# Altium schematic sheet FT601.SchDoc: FT601_V2
size A4; Date: 2019/08/25; CheckedBy: A Kadis; Author: DM Dong,YC Wang; CompanyName: CMMPE; DrawnBy: Daoming Dong, Youchao Wang; Revision: A; SheetNumber: 1; SheetTotal: 4
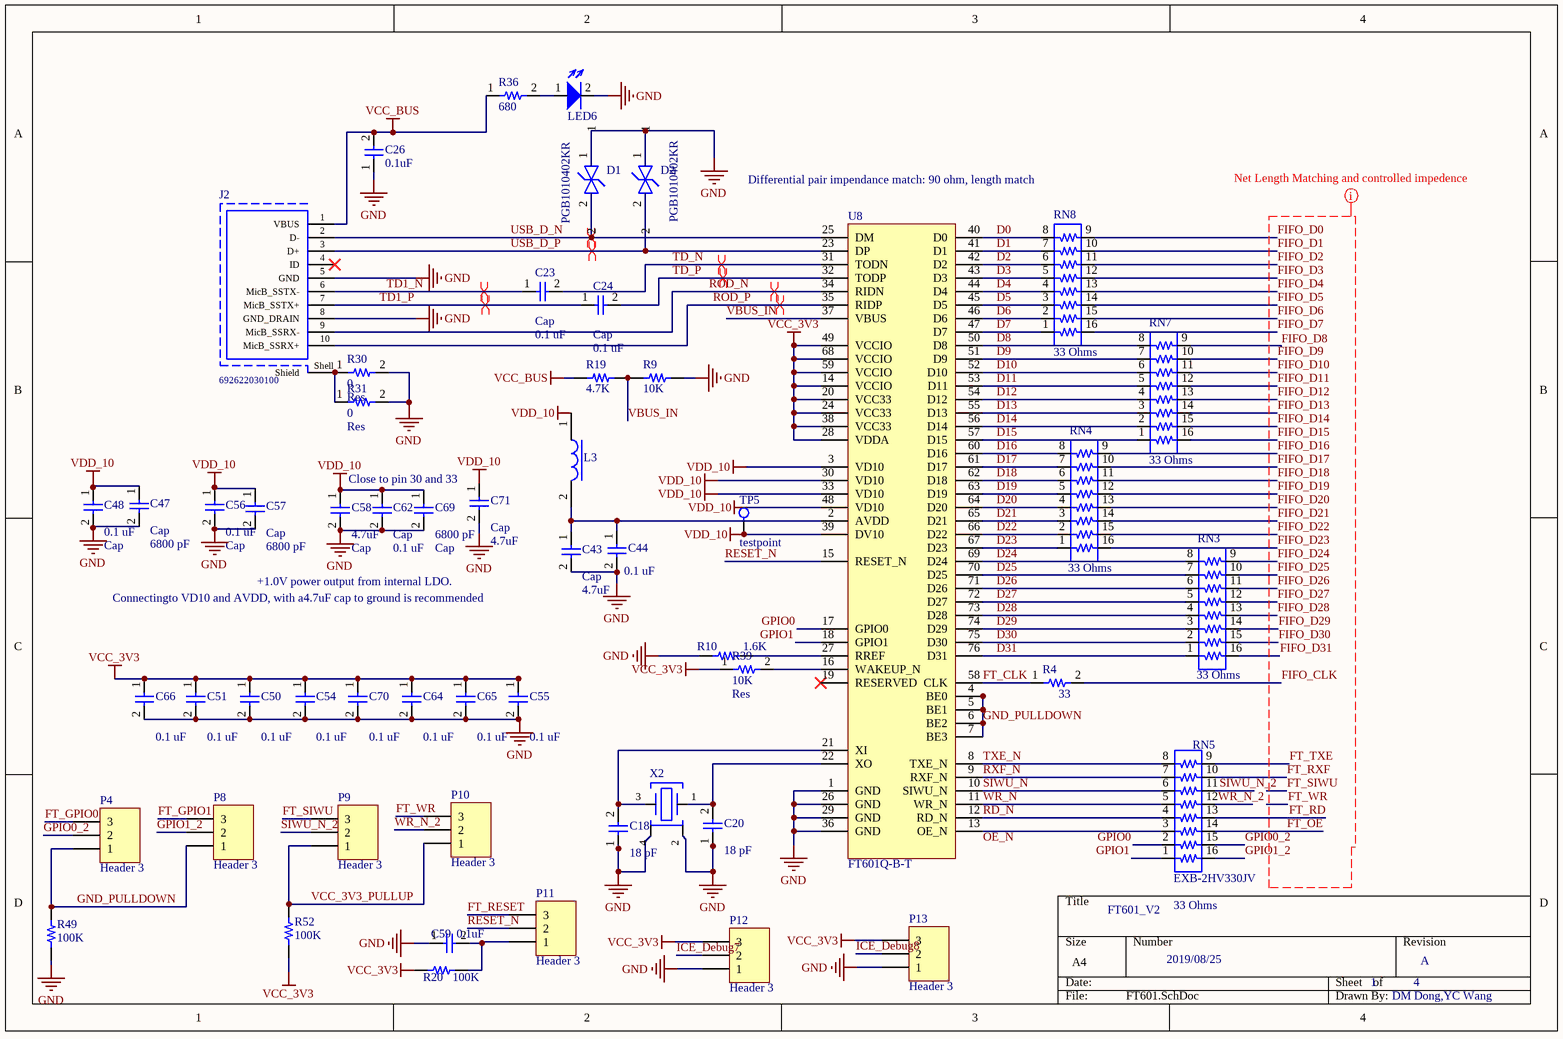
[diagram p0: FT601.SchDoc]

## Parts
C18  value 18 pF  [CAP_18pF_0603]  (hidden comment: C0603C180K5RACAUTO)
C20  value 18 pF  [CAP_18pF_0603]  (hidden comment: C0603C180K5RACAUTO)
C23  value 0.1 uF  Component Name: Cap  [Cap_0.1uF_0402]  (hidden comment: CC0402KPX5R6BB104)
C24  value 0.1 uF  Component Name: Cap  [Cap_0.1uF_0402]  (hidden comment: CC0402KPX5R6BB104)
C26  value 0.1uF  [Cap_0.1uF]  (hidden comment: AC0603KRX7R9BB104)
C43  value 4.7uF  Component Name: Cap  [CAP_4.7uF_0402]  (hidden comment: C1005X5R0J475K050BC)
C44  value 0.1 uF  [Cap_0.1uF_0402]  (hidden comment: CC0402KPX5R6BB104)
C47  value 6800 pF  Component Name: Cap  [CAP_6700pF_0402]  (hidden comment: C0402C682K5RECAUTO)
C48  value 0.1 uF  Component Name: Cap  [Cap_0.1uF_0402]  (hidden comment: CC0402KPX5R6BB104)
C50  value 0.1 uF  [Cap_0.1uF_0402]  (hidden comment: CC0402KPX5R6BB104)
C51  value 0.1 uF  [Cap_0.1uF_0402]  (hidden comment: CC0402KPX5R6BB104)
C54  value 0.1 uF  [Cap_0.1uF_0402]  (hidden comment: CC0402KPX5R6BB104)
C55  value 0.1 uF  [Cap_0.1uF_0402]  (hidden comment: CC0402KPX5R6BB104)
C56  value 0.1 uF  Component Name: Cap  [Cap_0.1uF_0402]  (hidden comment: CC0402KPX5R6BB104)
C57  value 6800 pF  Component Name: Cap  [CAP_6700pF_0402]  (hidden comment: C0402C682K5RECAUTO)
C58  value 4.7uF  Component Name: Cap  [CAP_4.7uF_0402]  (hidden comment: C1005X5R0J475K050BC)
C59  value 0.1uF  [Cap_0.1uF]  (hidden comment: AC0603KRX7R9BB104)
C62  value 0.1 uF  Component Name: Cap  [Cap_0.1uF_0402]  (hidden comment: CC0402KPX5R6BB104)
C64  value 0.1 uF  [Cap_0.1uF_0402]  (hidden comment: CC0402KPX5R6BB104)
C65  value 0.1 uF  [Cap_0.1uF_0402]  (hidden comment: CC0402KPX5R6BB104)
C66  value 0.1 uF  [Cap_0.1uF_0402]  (hidden comment: CC0402KPX5R6BB104)
C69  value 6800 pF  Component Name: Cap  [CAP_6700pF_0402]  (hidden comment: C0402C682K5RECAUTO)
C70  value 0.1 uF  [Cap_0.1uF_0402]  (hidden comment: CC0402KPX5R6BB104)
C71  value 4.7uF  Component Name: Cap  [CAP_4.7uF_0402]  (hidden comment: C1005X5R0J475K050BC)
D1  PGB1010402KR  [ESD_Suppressor]
D2  PGB1010402KR  [ESD_Suppressor]
J2  692622030100  [692622030100]
L3  BLM18PG300SZ1D  [FerriteBeads]  (value not drawn)
LED6  TLMS1000-GS08  [LED_RED]  (value not drawn)
P4  Header 3  [HDR1X3]
P8  Header 3  [HDR1X3]
P9  Header 3  [HDR1X3]
P10  Header 3  [HDR1X3]
P11  Header 3  [HDR1X3]
P12  Header 3  [HDR1X3]
P13  Header 3  [HDR1X3]
R4  value 33  [Res_33_0402]  (hidden comment: ERJ2RKD33R0X)
R9  value 10K  [RES_10K]  (hidden comment: RT0603WRE0710KL)
R10  value 1.6K  [RES_1.6K]  (hidden comment: ERJ-3RBD1601V)
R19  value 4.7K  [RES_4.7K]  (hidden comment: AC0603JR-134K7L)
R20  value 100K  [RES_100K]  (hidden comment: SR0603KR-07100KL)
R30  value 0  Component Name: Res  [RES_0]  (hidden comment: CRCW06030000Z0EAC)
R31  value 0  Component Name: Res  [RES_0]  (hidden comment: CRCW06030000Z0EAC)
R36  value 680  [RES_680]  (hidden comment: RT0603FRE13680RL)
R39  value 10K  Component Name: Res  [RES_10K]  (hidden comment: RT0603WRE0710KL)
R49  value 100K  [RESC1607X60N]  (hidden comment: SR0603KR-07100KL)
R52  value 100K  [RESC1607X60N]  (hidden comment: SR0603KR-07100KL)
RN3  value 33 Ohms  [ResArray_0]  (hidden comment: EXB-2HV330JV)
RN4  value 33 Ohms  [ResArray_0]  (hidden comment: EXB-2HV330JV)
RN5  EXB-2HV330JV  value 33 Ohms  [ResArray_0]
RN7  value 33 Ohms  [ResArray_0]  (hidden comment: EXB-2HV330JV)
RN8  value 33 Ohms  [ResArray_0]  (hidden comment: EXB-2HV330JV)
TP5  testpoint  [testpoint]
U8  FT601Q-B-T  [FT601_NoGND_Pad]
X2  ABM8G-30.000MHZ-18-D2Y-T  [30MHzOscillatorV2]  (value not drawn)

## Nets
GND: C18.1 C20.1 C26.1 C43.2 C44.2 C47.2 C48.2 C50.2 C51.2 C54.2 C55.2 C56.2 C57.2 C58.2 C59.1 C62.2 C64.2 C65.2 C66.2 C69.2 C70.2 C71.2 D1.1 D2.1 J2.5(GND) J2.8(GND_DRAIN) LED6.2(Cathode) P12.1 P13.1 R9.1 R10.1 R30.2 R31.2 R49.1 U8.1(GND) U8.26(GND) U8.29(GND) U8.36(GND) X2.2(GND) X2.4(GND)
VCC_3V3: C50.1 C51.1 C54.1 C55.1 C64.1 C65.1 C66.1 C70.1 P12.3 P13.3 R20.1 R39.1 R52.1 U8.14(VCCIO) U8.20(VCC33) U8.24(VCC33) U8.28(VDDA) U8.38(VCC33) U8.49(VCCIO) U8.59(VCCIO) U8.68(VCCIO)
VCC_BUS: C26.2 J2.1(VBUS) R19.2 R36.1
VDD_10: C47.1 C48.1 C56.1 C57.1 C58.1 C62.1 C69.1 C71.1 L3.1 TP5.1 U8.3(VD10) U8.30(VD10) U8.33(VD10) U8.39(DV10) U8.48(VD10)
D0: RN8.8 U8.40(D0)
D1: RN8.7 U8.41(D1)
D2: RN8.6 U8.42(D2)
D3: RN8.5 U8.43(D3)
D4: RN8.4 U8.44(D4)
D5: RN8.3 U8.45(D5)
D6: RN8.2 U8.46(D6)
D7: RN8.1 U8.47(D7)
D8: RN7.8 U8.50(D8)
D9: RN7.7 U8.51(D9)
D10: RN7.6 U8.52(D10)
D11: RN7.5 U8.53(D11)
D12: RN7.4 U8.54(D12)
D13: RN7.3 U8.55(D13)
D14: RN7.2 U8.56(D14)
D15: RN7.1 U8.57(D15)
D16: RN4.8 U8.60(D16)
D17: RN4.7 U8.61(D17)
D18: RN4.6 U8.62(D18)
D19: RN4.5 U8.63(D19)
D20: RN4.4 U8.64(D20)
D21: RN4.3 U8.65(D21)
D22: RN4.2 U8.66(D22)
D23: RN4.1 U8.67(D23)
D24: RN3.8 U8.69(D24)
D25: RN3.7 U8.70(D25)
D26: RN3.6 U8.71(D26)
D27: RN3.5 U8.72(D27)
D28: RN3.4 U8.73(D28)
D29: RN3.3 U8.74(D29)
D30: RN3.2 U8.75(D30)
D31: RN3.1 U8.76(D31)
FIFO_CLK: R4.2
FIFO_D0: RN8.9
FIFO_D1: RN8.10
FIFO_D2: RN8.11
FIFO_D3: RN8.12
FIFO_D4: RN8.13
FIFO_D5: RN8.14
FIFO_D6: RN8.15
FIFO_D7: RN8.16
FIFO_D8: RN7.9
FIFO_D9: RN7.10
FIFO_D10: RN7.11
FIFO_D11: RN7.12
FIFO_D12: RN7.13
FIFO_D13: RN7.14
FIFO_D14: RN7.15
FIFO_D15: RN7.16
FIFO_D16: RN4.9
FIFO_D17: RN4.10
FIFO_D18: RN4.11
FIFO_D19: RN4.12
FIFO_D20: RN4.13
FIFO_D21: RN4.14
FIFO_D22: RN4.15
FIFO_D23: RN4.16
FIFO_D24: RN3.9
FIFO_D25: RN3.10
FIFO_D26: RN3.11
FIFO_D27: RN3.12
FIFO_D28: RN3.13
FIFO_D29: RN3.14
FIFO_D30: RN3.15
FIFO_D31: RN3.16
FT_CLK: R4.1 U8.58(CLK)
FT_GPIO0: P4.3
FT_GPIO1: P8.3
FT_OE: RN5.14
FT_RD: RN5.13
FT_RESET: P11.3
FT_RXF: RN5.10
FT_SIWU: P9.3
FT_TXE: RN5.9
FT_WR: P10.3
GND_PULLDOWN: P4.1 P8.1 R49.2 U8.4(BE0) U8.5(BE1) U8.6(BE2) U8.7(BE3)
GPIO0: RN5.2 U8.17(GPIO0)
GPIO0_2: P4.2 RN5.15
GPIO1: RN5.1 U8.18(GPIO1)
GPIO1_2: P8.2 RN5.16
ICE_Debug7: P12.2
ICE_Debug8: P13.2
RD_N: RN5.4 U8.12(RD_N)
RESET_N: P11.2 U8.15(RESET_N)
ROD_N: J2.9(MicB_SSRX-) U8.34(RIDN)
ROD_P: J2.10(MicB_SSRX+) U8.35(RIDP)
RXF_N: RN5.7 U8.9(RXF_N)
SIWU_N: RN5.6 U8.10(SIWU_N)
SIWU_N_2: P9.2 RN5.11
TD1_N: C23.1 J2.6(MicB_SSTX-)
TD1_P: C24.1 J2.7(MicB_SSTX+)
TD_N: C23.2 U8.31(TODN)
TD_P: C24.2 U8.32(TODP)
TXE_N: RN5.8 U8.8(TXE_N)
USB_D_N: D1.2 J2.2(D-) U8.25(DM)
USB_D_P: D2.2 J2.3(D+) U8.23(DP)
VBUS_IN: R9.2 R19.1 U8.37(VBUS)
VCC_3V3_PULLUP: P9.1 P10.1 R52.2
WR_N: RN5.5 U8.11(WR_N)
WR_N_2: P10.2 RN5.12
NetC18_2: C18.2 U8.21(XI) X2.3(HOT)
NetC20_2: C20.2 U8.22(XO) X2.1(HOT)
NetC43_1: C43.1 C44.1 L3.2 U8.2(AVDD)
NetC59_2: C59.2 P11.1 R20.2
NetJ2_Shell: J2.Shell(Shield) R30.1 R31.1
NetLED6_1: LED6.1(Anode) R36.2
NetR10_2: R10.2 U8.27(RREF)
NetR39_2: R39.2 U8.16(WAKEUP_N)
NetRN5_3: RN5.3 U8.13(OE_N)

Not connected (* = marked no-connect by the designer): J2 4(ID)*; U8 19(RESERVED)*

## Layout directives
differential pair; differential pair class Diff90: ROD_N, ROD_P, TD1_N, TD1_P, TD_N, TD_P, USB_D_N, USB_D_P
rule Matched Net Lengths [Tolerance = 24.5mm]; net class FT601FIFO: FIFO_CLK, FIFO_D0, FIFO_D1, FIFO_D2, FIFO_D3, FIFO_D4, FIFO_D5, FIFO_D6, FIFO_D7, FIFO_D8, FIFO_D9, FIFO_D10, FIFO_D11, FIFO_D12, FIFO_D13, FIFO_D14, FIFO_D15, FIFO_D16, FIFO_D17, FIFO_D18, FIFO_D19, FIFO_D20, FIFO_D21, FIFO_D22, FIFO_D23, FIFO_D24, FIFO_D25, FIFO_D26, FIFO_D27, FIFO_D28, FIFO_D29, FIFO_D30, FIFO_D31, FT_OE, FT_RD, FT_RXF, FT_SIWU, FT_TXE, FT_WR

## Notes on the sheet
- Differential pair impendance match: 90 ohm, length match
- Close to pin 30 and 33
- +1.0V power output from internal LDO.
- Connectingto VD10 and AVDD, with a4.7uF cap to ground is recommended
- Labels drawn without touching a wire or pin: OE_N

## Library data of the parts
C18 C20 = Cap_18pF_0603: Multilayer Ceramic Capacitors MLCC - SMD/SMT 50V 18pF 0603 X7R 10% AEC-Q200; Manufacture: KEMET; Component Name: Cap; Manufacture No.: C0603C180K5RACAUTO; Mouser No.: 80-C0603C180K5RAUTO; Case Code: 0603; Datasheet URL.: https://www.mouser.co.uk/datasheet/2/212/KEM_C1023_X7R_AUTO_SMD-1093309.pdf
C23 C24 C48 C56 C62 = CAP_0.1uF_0402: Multilayer Ceramic Capacitors MLCC - SMD/SMT 100nF 10V X5R 10%; Manufacture: Yageo; Date Created: 11-Mar-2019; Created By: Daoming Dong; Manufacture No.: CC0402KPX5R6BB104; Mouser No.: 603-CC402KPX5R6BB104; Case Code: 0402; Datasheet URL.: https://www.mouser.co.uk/datasheet/2/447/UPY-GPHC_X5R_4V-to-50V_25-1131599.pdf
C26 C59 = Cap_0.1uF: Multilayer Ceramic Capacitors MLCC - SMD/SMT 0.1uF 10% 50V AEC-Q200; Component Name: Cap; Date Created: 01-Mar-2019; Created By: Daoming Dong; Datasheet URL: https://www.mouser.co.uk/datasheet/2/447/UPY-AC_NP0X7R_16V-to-630V_11-1511105.pdf; Package: 0603; Manufacture No.: AC0603KRX7R9BB104; Mouser No.: 603-AC0603KR9BB104
C43 C58 C71 = Cap_4.7uF_0402: Multilayer Ceramic Capacitors MLCC - SMD/SMT 0402 6.3V 4.7uF X5R 10% T: 0.5mm; Manufactue: TDK; Date Created: 13-Mar-2019; Created By: Daoming Dong; Manufacture No.: C1005X5R0J475K050BC; Mouser No.: 810-C1005X5R0J475K; Case Code: 0402; Datasheet URL.: https://www.mouser.co.uk/datasheet/2/400/lcc_commercial_general_en-837201.pdf
C44 C50 C51 C54 C55 C64-C66 C70 = CAP_0.1uF_0402: Multilayer Ceramic Capacitors MLCC - SMD/SMT 100nF 10V X5R 10%; Manufacture: Yageo; Component Name: Cap; Date Created: 11-Mar-2019; Created By: Daoming Dong; Manufacture No.: CC0402KPX5R6BB104; Mouser No.: 603-CC402KPX5R6BB104; Case Code: 0402; Datasheet URL.: https://www.mouser.co.uk/datasheet/2/447/UPY-GPHC_X5R_4V-to-50V_25-1131599.pdf
C47 C57 C69 = Cap_6800pF_0402: Multilayer Ceramic Capacitors MLCC - SMD/SMT 50V 6800pF X7R 0402 10% AEC-Q200; Manufacture: KEMET; Date Created: 18-Mar-2019; Created By: Daoming Dong; Manufacture No.: C0402C682K5RECAUTO; Mouser No.: 80-C0402C682K5RECAUT; Case Code: 0402; Datasheet URL.: https://www.mouser.co.uk/datasheet/2/212/KEM_C1090_X7R_ESD-1103328.pdf
D1 D2 = ESD_Suppresor: ESD Suppressors / TVS Diodes PULSEGUARD 0402 ESD SUPPRESSOR; Manufacature: Littelfuse; Manufacture No.: PGB1010402KR; Mouser No.: 576-PGB1010402KR; Date Created: 12-Mar-2019; Created By: Daoming Dong; Component Name: ESD Suppressor; Datasheet URL.: https://www.mouser.co.uk/datasheet/2/240/Littelfuse_PulseGuard_PGB1_Datasheet.pdf-461684.pdf; Case Code: 0402
J2 = 692622030100: Micro USB 3.0 Type B Receptacle WR-COM, Horizontal, SMT, with Pads; Rated Current: 0.25 A; Contact Resistance: 50 mOhm; Working Voltage: 30 VAC; ComponentLink1Description: Manufacturer; ComponentLink1URL: http://www.we-online.de; ComponentLink2Description: Datasheet; ComponentLink2URL: https://katalog.we-online.de/em/datasheet/692622030100.pdf; Part Number: 692622030100; Published Date: September 2018; Publisher: Wurth Elektronik; Orientation: Horizontal; Connector Type: Micro USB 3.0 Type B; Operating Temperature: -20 to 85 degC; Mounting Technology: SMT; Gender: Receptacle; Packaging: Tape and Reel
L3 = FerriteBeadForFT601: Ferrite Beads 0603 30ohms 1000mA Auto Infotainment; Manufacture: muRata; Value: 30R@100MHz/1A; Component Name: Ferrite Beads; Manufacture No.: BLM18PG300SZ1D; Mouser No.: 81-BLM18PG300SZ1D; Datasheet URL.: https://www.mouser.co.uk/datasheet/2/281/c51e-794816.pdf; Created By: Daoming Dong; Data Created: 25th-Mar-2019; Case Code: 0603
LED6 = LED_RED: Standard LEDs - SMD RED; Component Name: LED_R; Vf: 1.8V; Created By: Daoming Dong; Date Created: 11-Mar-2018; Manufacture No.: TLMS1000-GS08; Mouser No.: 78-TLMS1000; Case Code: 0603; Datasheet URL.: https://www.mouser.co.uk/datasheet/2/427/tlmb1100-279843.pdf
P4 P8-P13 = Header 3: Header, 3-Pin; LatestRevisionDate: 17-Jul-2002; LatestRevisionNote: Re-released for DXP Platform.; Publisher: Altium Limited
R4 = Res_33_0402: Thick Film Resistors - SMD 0402 Resistor 0.5% 100ppm 33Ohm; Manufacture: Panasonic; Created By.: Daoming Dong; Component Name: Res; Manufcature No.: ERJ2RKD33R0X; Mouser No.: 667-ERJ-2RKD33R0X; Date Created: 12-Mar-2019; Datasheet URL.: https://www.mouser.co.uk/datasheet/2/315/AOA0000C304-1149620.pdf; Case Code: 0402
R9 = Res_10K: Thin Film Resistors - SMD 10K ohm 0.05% 50 ppm High-Precision; Manufacture: Yageo; Component Name: Res; Manufacture No.: RT0603WRE0710KL; Mouser No.: 603-RT0603WRE0710KL; Created By: Daoming Dong; Date Created: 02-Mar-2019; Datasheet URL.: https://www.mouser.co.uk/datasheet/2/447/PYu-RT_1-to-0.01_RoHS_L_9-1222720.pdf; Case Code: 0603
R10 = Res_1.6K: Thick Film Resistors - SMD 0603 Resistor 0.5% 50ppm 1.6KOhm; Manufacture: Panasonic; Component Name: Res; Created By: Daoming Dong; Date Created: 02-Mar-2019; Manufacture No.: ERJ-3RBD1601V; Mouser No.: 667-ERJ-3RBD1601V; Case Code: 0603; Datasheet URL.: https://www.mouser.co.uk/datasheet/2/315/AOA0000C304-1149620.pdf
R19 = Res_4.7K: Thick Film Resistors - SMD 4.7K ohm 5% 1/10W AEC-Q200; Manufacture: Yageo; Component Name: Res; Manufacture No.: AC0603JR-134K7L; Mouser No.: 603-AC0603JR-134K7L; Created By: Daoming Dong; Date Created: 02-Mar-2019; Case Code: 0603; Datasheet URL.: https://www.mouser.co.uk/datasheet/2/447/PYu-AC_51_RoHS_L_6-1152827.pdf
R20 R49 R52 = Res_100K: Thick Film Resistors - SMD 100K ohm 10% 75V AEC-Q200; Manufacture: Yageo; Component Name: Res; Manufacture No.: SR0603KR-07100KL; Mouser No.: 603-SR0603KR-07100KL; Date Created: 02-Mar-2019; Created By: Daoming Dong; Datasheet URL.: https://www.mouser.co.uk/datasheet/2/447/PYu-SR_20105_RoHS_L_7-1488668.pdf; Case Code: 0603
R30 R31 = Res_0: Thick Film Resistors - SMD 1/10Watt 0ohms Commercial Use; Manufacture: Vishay; Case Code: 0603; Manufacture No.: CRCW06030000Z0EAC; Mouser No.: 71-CRCW06030000Z0EAC; Created By: Daoming Dong; Date Created: 02-Mar-2019; Datasheet URL.: https://www.mouser.co.uk/datasheet/2/427/crcwce3-1223726.pdf
R36 = Res_680: Thin Film Resistors - SMD 680 ohm 1% 50 ppm Thin Film; Manufacture: Yageo; Component Name: Res; Manufacture No.: RT0603FRE13680RL; Mouser No.: 603-RT0603FRE13680RL; Created By: Daoming Dong; Date Created: 02-Mar-2019; Datasheet URL.: https://www.mouser.co.uk/datasheet/2/447/PYu-RT_1-to-0.01_RoHS_L_9-1222720.pdf; Case Code: 0603
R39 = Res_10K: Thin Film Resistors - SMD 10K ohm 0.05% 50 ppm High-Precision; Manufacture: Yageo; Manufacture No.: RT0603WRE0710KL; Mouser No.: 603-RT0603WRE0710KL; Created By: Daoming Dong; Date Created: 02-Mar-2019; Datasheet URL.: https://www.mouser.co.uk/datasheet/2/447/PYu-RT_1-to-0.01_RoHS_L_9-1222720.pdf; Case Code: 0603
RN3-RN5 RN7 RN8 = ResArray: Resistor Networks & Arrays 33 OHM 5%; Component Name: Resistor Array; Manufacture No.: EXB-2HV330JV; Mouser No.: 667-EXB-2HV330JV; Datasheet URL.: https://www.mouser.co.uk/datasheet/2/315/AOC0000C14-1108062.pdf; Date Created: 11-Mar-2019
TP5 = Testpoint: Testpoint for testing voltage; Created By: Daoming Dong; Date Created: 11-Mar-2019
U8 = FT601Q-B-T: USB Interface IC USB 3.0 Super-Speed 32Bits Sync FIFO; Created By: Daoming Dong; Farnell Order Code: 2748207; Manufacture Part No.: FT601Q-B-T; RS Stock No.: 146-6840; Date Created: 25th Feb 2019; Datasheet URL: http://www.farnell.com/datasheets/2263949.pdf
X2 = 30MHzOscillator: Crystals 30.000MHz 18pF 30ppm -40C +85C; Created By: Youchao Wang; Date Created: 29th Aug 2019; Manufacture No.: ABM8G-30.000MHZ-18-D2Y-T; Datasheet URL.: https://www.mouser.co.uk/datasheet/2/3/ABM8G-10572.pdf; Mouser Stock No.: 815-ABM8G-30-18D2Y; Component Name: 30MHz Oscillator